# Altium schematic sheet Sheet_1_2021-12-20.schdoc
size 49 x 29 mm
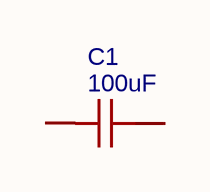
[diagram p0: Sheet_1_2021-12-20.schdoc]

## Parts
C1  100uF  [C1206]

## Nets

Not connected (* = marked no-connect by the designer): C1 1 2

## Library data of the parts
C1 = 100uF: BOM_Manufacturer: Murata Electronics; BOM_Manufacturer Part: GRM31CR61A107ME05L; nameAlias: Capacitance; Contributor: LCSC; BOM_Supplier: LCSC; BOM_Supplier Part: C312983; BOM_JLCPCB Part Class: Extended Part; spicePre: C; spiceSymbolName: GRM31CR61A107ME05L